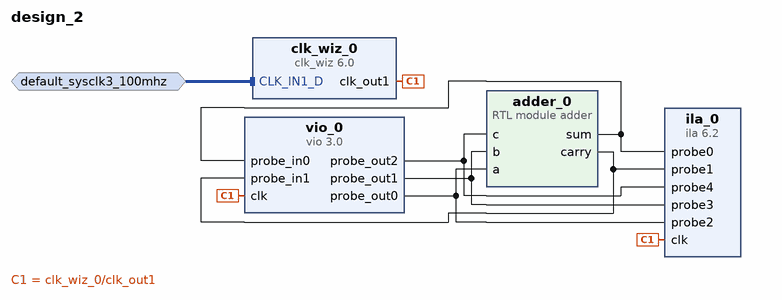
[diagram p0: block diagram of the top level]
# Vivado block design design_2, xczu28dr-ffvg1517-2-e, Vivado 2019.2
create_bd_design design_2

create_bd_intf_port -mode Slave -vlnv xilinx.com:interface:diff_clock_rtl:1.0 default_sysclk3_100mhz
set_property -dict {CONFIG.FREQ_HZ 100000000} [get_bd_intf_ports default_sysclk3_100mhz]

create_bd_cell -type module -reference adder adder_0
create_bd_cell -type ip -vlnv xilinx.com:ip:vio:3.0 vio_0
set_property -dict {CONFIG.C_NUM_PROBE_IN 2 CONFIG.C_NUM_PROBE_OUT 3} [get_bd_cells vio_0]
create_bd_cell -type ip -vlnv xilinx.com:ip:ila:6.2 ila_0
set_property -dict {CONFIG.C_ENABLE_ILA_AXI_MON false CONFIG.C_MONITOR_TYPE Native CONFIG.C_NUM_OF_PROBES 5} [get_bd_cells ila_0]
create_bd_cell -type ip -vlnv xilinx.com:ip:clk_wiz:6.0 clk_wiz_0
set_property -dict [list \
  CONFIG.CLK_IN1_BOARD_INTERFACE default_sysclk3_100mhz \
  CONFIG.USE_BOARD_FLOW true \
  CONFIG.USE_LOCKED false \
  CONFIG.USE_RESET false \
] [get_bd_cells clk_wiz_0]

# ---- connections ----

connect_bd_intf_net [get_bd_intf_ports default_sysclk3_100mhz] [get_bd_intf_pins clk_wiz_0/CLK_IN1_D]
connect_bd_net -net clk_0_1 [get_bd_pins clk_wiz_0/clk_out1] [get_bd_pins vio_0/clk] [get_bd_pins ila_0/clk]
connect_bd_net [get_bd_pins adder_0/sum] [get_bd_pins vio_0/probe_in0] [get_bd_pins ila_0/probe0]
connect_bd_net [get_bd_pins adder_0/carry] [get_bd_pins vio_0/probe_in1] [get_bd_pins ila_0/probe1]
connect_bd_net [get_bd_pins vio_0/probe_out2] [get_bd_pins adder_0/c] [get_bd_pins ila_0/probe4]
connect_bd_net [get_bd_pins vio_0/probe_out1] [get_bd_pins adder_0/b] [get_bd_pins ila_0/probe3]
connect_bd_net [get_bd_pins vio_0/probe_out0] [get_bd_pins adder_0/a] [get_bd_pins ila_0/probe2]

validate_bd_design
save_bd_design
